# EAGLE design atmega4089-breakout (EAGLE 9.4.0)
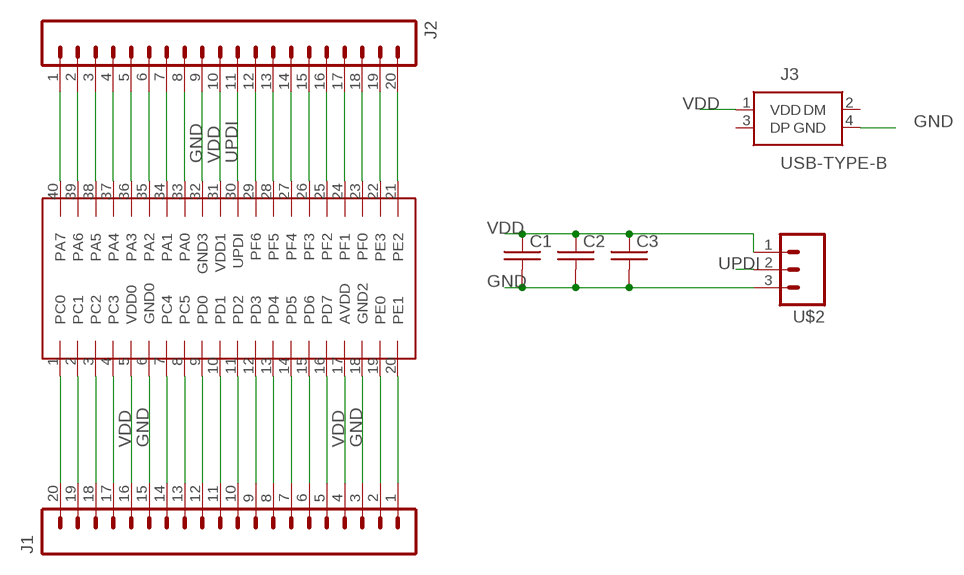
[diagram p0: schematic, sheet 1]

## Parts
C1  C-USC0805  [C0805]
C2  C-USC0805  [C0805]
C3  C-USC0805  [C0805]
J1  M20  [1X20]
J2  M20  [1X20]
J3  USB-TYPE-B  [61400413321]
U$1  ATMEGA4809-PFATMEL4809-PF  [DIP1587W58P254L5175H635Q40B]
U$2  M03  [1X03_UDPI]

## Nets
GND: C1.2 C2.2 C3.2 J1.3 J1.15 J2.9 J3.4(GND) U$1.6(GND0) U$1.18(GND2) U$1.32(GND3) U$2.3
N$1: J2.1 U$1.40(PA7)
N$2: J2.2 U$1.39(PA6)
N$3: J2.3 U$1.38(PA5)
N$4: J2.4 U$1.37(PA4)
N$5: J2.5 U$1.36(PA3)
N$6: J2.6 U$1.35(PA2)
N$7: J2.7 U$1.34(PA1)
N$8: J2.8 U$1.33(PA0)
N$11: J2.12 U$1.29(PF6)
N$12: J2.13 U$1.28(PF5)
N$13: J2.14 U$1.27(PF4)
N$14: J2.15 U$1.26(PF3)
N$15: J2.16 U$1.25(PF2)
N$16: J2.17 U$1.24(PF1)
N$17: J2.18 U$1.23(PF0)
N$18: J2.19 U$1.22(PE3)
N$19: J2.20 U$1.21(PE2)
N$20: J1.1 U$1.20(PE1)
N$21: J1.2 U$1.19(PE0)
N$24: J1.5 U$1.16(PD7)
N$25: J1.6 U$1.15(PD6)
N$26: J1.7 U$1.14(PD5)
N$27: J1.8 U$1.13(PD4)
N$28: J1.9 U$1.12(PD3)
N$29: J1.10 U$1.11(PD2)
N$30: J1.11 U$1.10(PD1)
N$31: J1.12 U$1.9(PD0)
N$32: J1.13 U$1.8(PC5)
N$33: J1.14 U$1.7(PC4)
N$36: J1.17 U$1.4(PC3)
N$37: J1.18 U$1.3(PC2)
N$38: J1.19 U$1.2(PC1)
N$39: J1.20 U$1.1(PC0)
UPDI: J2.11 U$1.30(UPDI) U$2.2
VDD: C1.1 C2.1 C3.1 J1.4 J1.16 J2.10 J3.1(VDD) U$1.5(VDD0) U$1.17(AVDD) U$1.31(VDD1) U$2.1
Unconnected: J3.2(DM) J3.3(DP)

## Library data of the parts
C1-C3 = passives:C-US: CAPACITOR, American symbol
J1 J2 = connector:M20: 1x20 .1" header This is just like the LOCK variant in that the holes are staggared by 5 mil, but except for the last two holes. They are not altered from the "standard" footprint layout. This is used for a special purpose on the layout of our Graphic LCD Backpack. Make sure you want to use this device before selecting it for you project!
J3 = connector:USB-TYPE-B: WR-COM USB Connector B vertical Wurth Elektronik Straight PCB Mount Mount Female Type B USB Connector, 30 V ac, 1.5A Source: Datasheet <https://componentsearchengine.com/Datasheets/1/61400413321.pdf>; DESCRIPTION: WR-COM USB Connector B vertical Wurth Elektronik Straight PCB Mount Mount Female Type B USB Connector, 30 V ac, 1.5A; HEIGHT: mm; MANUFACTURER_NAME: Wurth Elektronik; MANUFACTURER_PART_NUMBER: 61400413321; MOUSER_PART_NUMBER: 710-61400413321; MOUSER_PRICE-STOCK: https://www.mouser.com/Search/Refine.aspx?Keyword=710-61400413321
U$1 = ICs:ATMEGA4809-PF: datasheet <https://www.microchip.com/wwwproducts/en/ATMEGA4809#datasheet-toggle>
U$2 = connector:M03: Header 3 Standard 3-pin 0.1" header. Use with straight break away headers (SKU : PRT-00116), right angle break away headers (PRT-00553), swiss pins (PRT-00743), machine pins (PRT-00117), and female headers (PRT-00115). Molex polarized connector foot print use with SKU : PRT-08232 with associated crimp pins and housings.

## Board
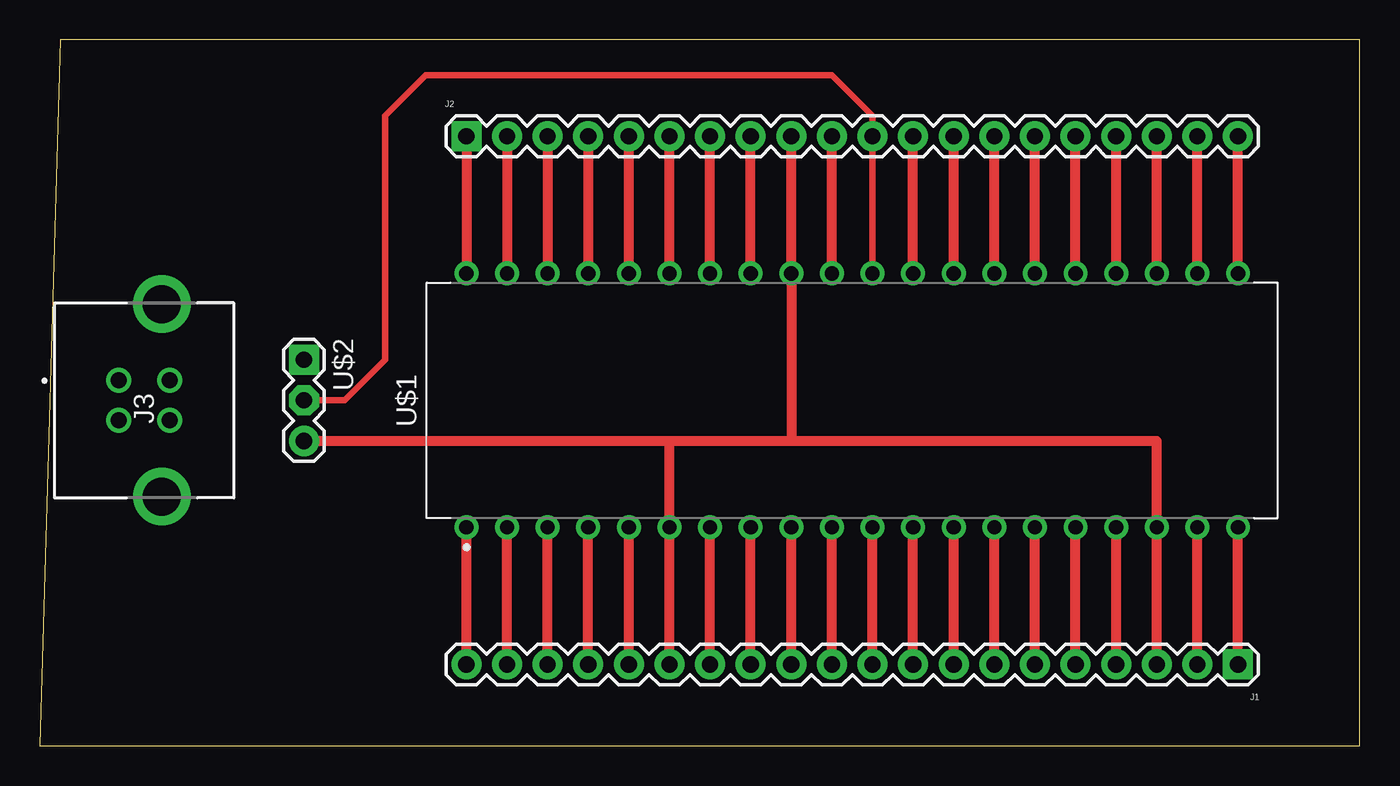
[diagram p1: board, top side]
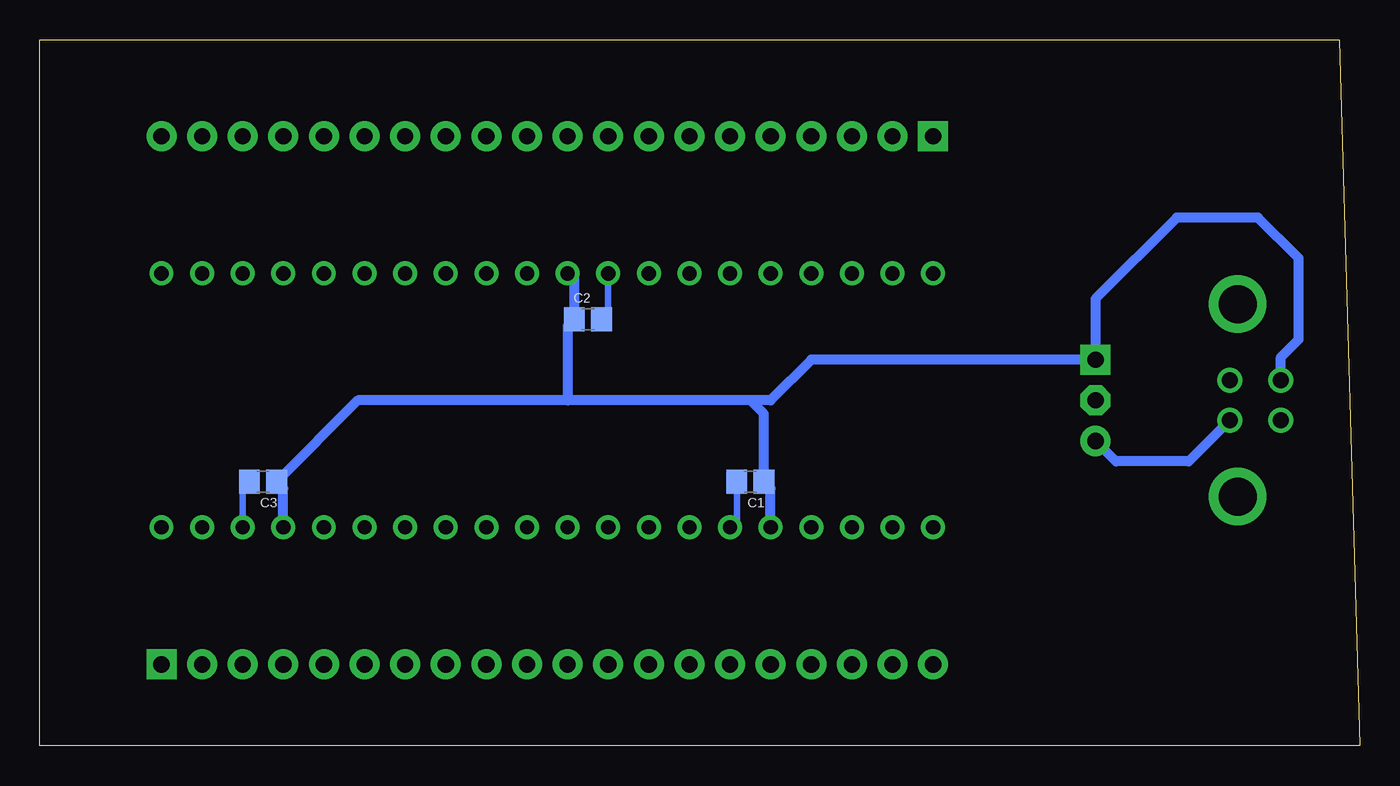
[diagram p2: board, bottom side, seen from below]

Size 82.53 x 44.12 mm. Coordinates in mm from the lower left corner, seen from the top.
Outline: 0,0 82.53,0 82.53,44.12 1.27,44.12 0,0
Copper layers (1*16): Top 0.035mm / dielectric 1.5mm / Bottom 0.035mm
Design rules "default": minimum track width 6mil, minimum drill 0.35mm, track to track 6mil, track to pad 6mil, pad to pad 6mil, via to via 6mil, smd to smd 6mil, copper to edge 40mil, drill to drill 6mil, minimum pad ring 10mil, minimum via ring 8mil, stop-mask expansion 4mil, vias tented up to drill 0mil, thermal gap 10mil

### Footprints (pad centres in the part's own frame; a part is rotated, then mirrored left to right if it is on the bottom)
C0805 = smd 1.3 x 1.5: 1 -0.85,0; 2 0.85,0
1X20 = drill 1.016 pad 1.88 square: 1 0,0 | drill 1.016 pad 1.88: 2 2.54,0; 3 5.08,0; 4 7.62,0; 5 10.16,0; 6 12.7,0; 7 15.24,0; 8 17.78,0; 9 20.32,0; 10 22.86,0; 11 25.4,0; 12 27.94,0; 13 30.48,0; 14 33.02,0; 15 35.56,0; 16 38.1,0; 17 40.64,0; 18 43.18,0; 19 45.72,0; 20 48.26,0
61400413321 = drill 1 pad 1.55: 1 1.25,2.7; 2 -1.25,2.7; 3 1.25,-0.5; 4 -1.25,-0.5 | drill 2.38 pad 3.59: 5 -6.02,0; 6 6.02,0
DIP1587W58P254L5175H635Q40B = drill 0.894 pad 1.494: 1 -7.938,24.13; 2 -7.938,21.59; 3 -7.938,19.05; 4 -7.938,16.51; 5 -7.938,13.97; 6 -7.938,11.43; 7 -7.938,8.89; 8 -7.938,6.35; 9 -7.938,3.81; 10 -7.938,1.27; 11 -7.938,-1.27; 12 -7.938,-3.81; 13 -7.938,-6.35; 14 -7.938,-8.89; 15 -7.938,-11.43; 16 -7.938,-13.97; 17 -7.938,-16.51; 18 -7.938,-19.05; 19 -7.938,-21.59; 20 -7.938,-24.13; 21 7.938,-24.13; 22 7.938,-21.59; 23 7.938,-19.05; 24 7.938,-16.51; 25 7.938,-13.97; 26 7.938,-11.43; 27 7.938,-8.89; 28 7.938,-6.35; 29 7.938,-3.81; 30 7.938,-1.27; 31 7.938,1.27; 32 7.938,3.81; 33 7.938,6.35; 34 7.938,8.89; 35 7.938,11.43; 36 7.938,13.97; 37 7.938,16.51; 38 7.938,19.05; 39 7.938,21.59; 40 7.938,24.13
1X03_UDPI = drill 1.016 pad 1.88 square: 1 0,0 | drill 1.016 pad 1.88 octagon: 2 2.54,0 | drill 1.016 pad 1.88: 3 5.08,0

### Placement (x,y rotation side)
C1  38.1,16.51 180 bottom
C2  48.26,26.67 0 bottom
C3  68.58,16.51 180 bottom
J1  74.93,5.08 180 top
J2  26.67,38.1 0 top
J3  7.62,21.59 90 top
U$1  50.8,21.59 90 top
U$2  16.51,24.13 270 top

### Tracks (layer width: path | path; a pad name or v marks a point on that pad's centre or on a via)
GND
  Top 0.406: U$1.6 39.37,13.97 | U$1.18 69.85,13.97
  Top 0.61: U$2.3 39.37,19.05 | 39.37,19.05 46.99,19.05 | 46.99,19.05 69.85,19.05 69.85,13.97 J1.3 | 39.37,19.05 39.37,13.97 J1.15 | 46.99,19.05 U$1.32 J2.9
  Bottom 0.406: U$1.6 38.95,14.07 C1.2 | C2.2 46.99,27.09 U$1.32 | C3.2 69.85,16.09 U$1.18
  Bottom 0.61: J3.4 10.68,17.78 15.24,17.78 U$2.3
N$1
  Top 0.61: J2.1 U$1.40
N$2
  Top 0.61: J2.2 U$1.39
N$3
  Top 0.61: J2.3 U$1.38
N$4
  Top 0.61: J2.4 U$1.37
N$5
  Top 0.61: U$1.36 J2.5
N$6
  Top 0.61: U$1.35 J2.6
N$7
  Top 0.61: U$1.34 J2.7
N$8
  Top 0.61: U$1.33 J2.8
N$11
  Top 0.61: U$1.29 J2.12
N$12
  Top 0.61: U$1.28 J2.13
N$13
  Top 0.61: U$1.27 J2.14
N$14
  Top 0.61: U$1.26 J2.15
N$15
  Top 0.61: U$1.25 J2.16
N$16
  Top 0.61: U$1.24 J2.17
N$17
  Top 0.61: U$1.23 J2.18
N$18
  Top 0.61: U$1.22 J2.19
N$19
  Top 0.61: U$1.21 J2.20
N$20
  Top 0.61: J1.1 U$1.20
N$21
  Top 0.61: J1.2 U$1.19
N$24
  Top 0.61: J1.5 U$1.16
N$25
  Top 0.61: J1.6 U$1.15
N$26
  Top 0.61: J1.7 U$1.14
N$27
  Top 0.61: J1.8 U$1.13
N$28
  Top 0.61: J1.9 U$1.12
N$29
  Top 0.61: J1.10 U$1.11
N$30
  Top 0.61: J1.11 U$1.10
N$31
  Top 0.61: J1.12 U$1.9
N$32
  Top 0.61: J1.13 U$1.8
N$33
  Top 0.61: J1.14 U$1.7
N$36
  Top 0.61: J1.17 U$1.4
N$37
  Top 0.61: J1.18 U$1.3
N$38
  Top 0.61: J1.19 U$1.2
N$39
  Top 0.61: J1.20 U$1.1
UPDI
  Top 0.406: U$2.2 19.05,21.59 21.59,24.13 21.59,39.37 24.13,41.91 49.53,41.91 52.07,39.37 J2.11 U$1.30
VDD
  Top 0.406: 15.88,24.77 U$2.1
  Top 0.61: U$1.31 J2.10 | J1.16 U$1.5 | J1.4 U$1.17
  Bottom 0.406: C2.1 49.53,26.25 | C1.1 36.83,16.93
  Bottom 0.61: J3.1 4.92,24.29 3.81,25.4 3.81,30.48 6.35,33.02 11.43,33.02 16.51,27.94 U$2.1 34.29,24.13 36.83,21.59 38.1,21.59 | 38.1,21.59 49.53,21.59 | 49.53,21.59 62.65,21.59 C3.1 67.31,16.09 U$1.17 | 49.53,26.25 49.53,21.59 | C2.1 49.11,29.11 U$1.31 | U$1.5 36.83,16.09 C1.1 37.25,20.74 38.1,21.59